# EAGLE schematic 5V AC-DC (EAGLE 9.6.2)
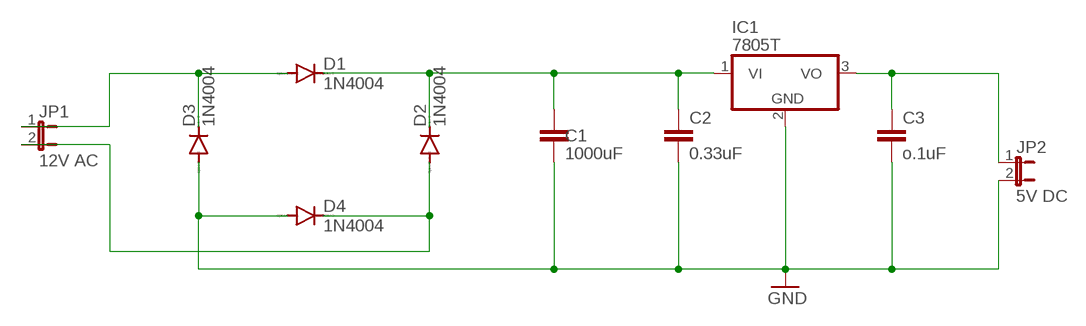
[diagram p0: schematic, sheet 1]

## Parts
C1  1000uF  C2,5-3  [C2.5-3]
C2  0.33uF  C2,5-3  [C2.5-3]
C3  o.1uF  C2,5-3  [C2.5-3]
D1  1N4004  [DO41-10]
D2  1N4004  [DO41-10]
D3  1N4004  [DO41-10]
D4  1N4004  [DO41-10]
IC1  7805T  [TO220H]
JP1  12V AC  JP1E  [JP1]
JP2  5V DC  JP1E  [JP1]

## Nets
N$1: D1.A D3.C JP1.1
N$2: C1.2 C2.2 C3.2 D3.A D4.A IC1.2(GND) JP2.2 ; supply symbol labelled GND
N$3: D2.A D4.C JP1.2
N$4: C1.1 C2.1 D1.C D2.C IC1.1(VI)
N$5: C3.1 IC1.3(VO) JP2.1

## Library data of the parts
C1-C3 = capacitor-wima:C: CAPACITOR naming: grid - package width
D1-D4 = diode:1N4004: DIODE general purpose rectifier, 1 A
IC1 = linear:78*: Positive VOLTAGE REGULATOR Source: http://cache.national.com/ds/LM/LM78L05.pdf http://www.fairchildsemi.com/ds/LM/LM7805.pdf
JP1 JP2 = jumper:JP1E: JUMPER